# Altium schematic sheet Schematic.SchDoc
size A; SheetNumber: 1; SheetTotal: 1
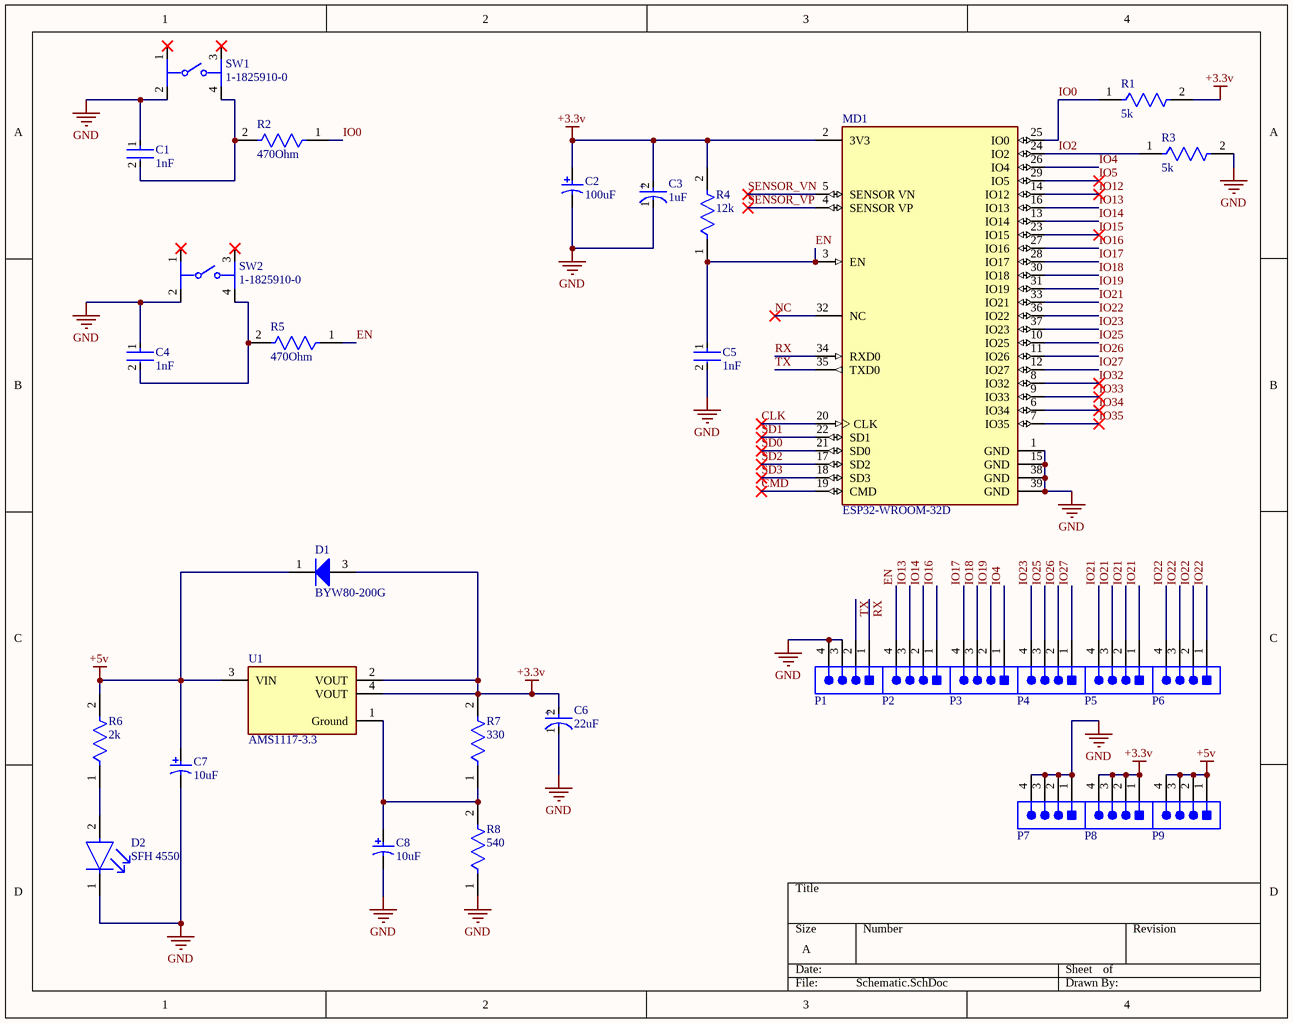
[diagram p0: Schematic.SchDoc]

## Parts
C1  1nF  [FP-VY2102M29Y5US6TV7-MFG]
C2  100uF  [NIC-RNS-8x11.5-2_V]
C3  1uF  [FP-ECA-2WHG010-MFG]
C4  1nF  [FP-VY2102M29Y5US6TV7-MFG]
C5  1nF  [FP-VY2102M29Y5US6TV7-MFG]
C6  22uF  [FP-RAD-TH-D_16_0_5-L_20_2-MFG]
C7  10uF  [NIC-RNS-8x11.5-2_V]
C8  10uF  [NIC-RNS-8x11.5-2_V]
D1  BYW80-200G  [ONSC-TO-220-2-221B-04_E]
D2  SFH 4550  [FP-SFH_4550-MFG]
MD1  ESP32-WROOM-32D  [FP-ESP32-WROOM-32D-MFG]
P1  B4B-EH-A(LF)(SN)  [JST-B4B-EH-A_V]  (value not drawn)
P2  B4B-EH-A(LF)(SN)  [JST-B4B-EH-A_V]  (value not drawn)
P3  B4B-EH-A(LF)(SN)  [JST-B4B-EH-A_V]  (value not drawn)
P4  B4B-EH-A(LF)(SN)  [JST-B4B-EH-A_V]  (value not drawn)
P5  B4B-EH-A(LF)(SN)  [JST-B4B-EH-A_V]  (value not drawn)
P6  B4B-EH-A(LF)(SN)  [JST-B4B-EH-A_V]  (value not drawn)
P7  B4B-EH-A(LF)(SN)  [JST-B4B-EH-A_V]  (value not drawn)
P8  B4B-EH-A(LF)(SN)  [JST-B4B-EH-A_V]  (value not drawn)
P9  B4B-EH-A(LF)(SN)  [JST-B4B-EH-A_V]  (value not drawn)
R1  5k  [FP-MRS1600-MFG]
R2  470Ohm  [FP-MRS1600-MFG]
R3  5k  [FP-MRS1600-MFG]
R4  12k  [FP-MRS1600-MFG]
R5  470Ohm  [FP-MRS1600-MFG]
R6  2k  [FP-MRS1600-MFG]
R7  330  [FP-MRS1600-MFG]
R8  540  [FP-MRS1600-MFG]
SW1  1-1825910-0  [FP-1-1825910-0-MFG]
SW2  1-1825910-0  [FP-1-1825910-0-MFG]
U1  AMS1117-3.3  [FP-AMS1117-IPC_C]

## Nets
+3.3v: C2.1 C3.2(A) C6.2(A) D1.3(A) MD1.2(3V3) P8.1 P8.2 P8.3 P8.4 R1.2 R4.2 R7.2 U1.2(VOUT) U1.4(VOUT)
+5v: C7.1 D1.1(K) P9.1 P9.2 P9.3 P9.4 R6.2 U1.3(VIN)
GND: C1.1 C2.2 C3.1(C) C4.1 C5.2 C6.1(C) C7.2 C8.2 D2.1(C) MD1.1(GND) MD1.15(GND) MD1.38(GND) MD1.39(GND) P1.3 P1.4 P7.1 P7.2 P7.3 P7.4 R3.2 R8.1 SW1.2 SW2.2
CLK: MD1.20(CLK)
CMD: MD1.19(CMD)
EN: C5.1 MD1.3(EN) P2.4 R4.1 R5.1
IO0: MD1.25(IO0) R1.1 R2.1
IO2: MD1.24(IO2) R3.1
IO4: MD1.26(IO4) P3.1
IO5: MD1.29(IO5)
IO12: MD1.14(IO12)
IO13: MD1.16(IO13) P2.3
IO14: MD1.13(IO14) P2.2
IO15: MD1.23(IO15)
IO16: MD1.27(IO16) P2.1
IO17: MD1.28(IO17) P3.4
IO18: MD1.30(IO18) P3.3
IO19: MD1.31(IO19) P3.2
IO21: MD1.33(IO21) P5.1 P5.2 P5.3 P5.4
IO22: MD1.36(IO22) P6.1 P6.2 P6.3 P6.4
IO23: MD1.37(IO23) P4.4
IO25: MD1.10(IO25) P4.3
IO26: MD1.11(IO26) P4.2
IO27: MD1.12(IO27) P4.1
IO32: MD1.8(IO32)
IO33: MD1.9(IO33)
IO34: MD1.6(IO34)
IO35: MD1.7(IO35)
NC: MD1.32(NC)
RX: MD1.34(RXD0) P1.1
SD0: MD1.21(SD0)
SD1: MD1.22(SD1)
SD2: MD1.17(SD2)
SD3: MD1.18(SD3)
SENSOR_VN: MD1.5(SENSOR_VN)
SENSOR_VP: MD1.4(SENSOR_VP)
TX: MD1.35(TXD0) P1.2
NetC1_2: C1.2 R2.2 SW1.4
NetC4_2: C4.2 R5.2 SW2.4
NetC8_1: C8.1 R7.1 R8.2 U1.1(Ground)
NetD2_2: D2.2(A) R6.1

Not connected (* = marked no-connect by the designer): SW1 1* 3*; SW2 1* 3*

## Notes on the sheet
- (in symbol CMP-00287-55558411-1) +
- (in symbol CMP-05427-000893-1) +

## Library data of the parts
C1 C4 C5 = CMP-00030-42817980-1: VY2102M29Y5US6TV7 Cap Ceramic Suppression X1/Y2 0.001uF 440VAC/300VAC Y5U 20% (7.5 X 5mm) Radial 7.5mm 125C T/R; Lead/Base Style: Kinked; Lead Diameter: 600µm; Voltage: 300V; Voltage Rating: 1kV; Capacitance: 1nF; Case/Package: Radial; Height: 10.5mm; REACH SVHC: Unknown; Packaging: Tape & Reel (TR); Lead Free: Lead Free; RoHS: Compliant; Min Operating Temperature: -40°C; Max Operating Temperature: 125°C; Termination: Radial; Composition: Ceramic; Depth: 5mm; Dielectric: Y5U; Diameter: 7.5mm; Lead Pitch: 7.5mm; Schedule B: 8532230060, 8532230060; Radiation Hardening: No; Tolerance: 20%; Height - Seated (Max): 11.5062mm; Voltage Rating (AC): 300V; Material: Ceramic; Mount: Through Hole; NexarPartId: 42817980
C2 = CMP-1235-00001-1: Aluminum Electrolytic Capacitor, 100 uF +/-20%, 10 V, -55 to 105 degC, 2-Pin THD, RoHS; PartNumber: RNS1A101MDN1KX; Manufacturer: Nichicon; Rated Ripple: 3900 mA; Rated Voltage: 10 V; Leakage Current: 0.15 mA; Capacitance Tolerance: +/-20%; ComponentLink1URL: http://www.nichicon.co.jp/; ComponentLink3URL: http://www.nichicon.co.jp/english/products/pdf/2013fpcap_catalog_ns.pdf; ComponentLink1Description: Manufacturer URL; ComponentLink2URL: http://www.nichicon.co.jp/english/products/pdfs/e-ns.pdf; PackageDescription: 2-Pin Through Hole Device, Dia 8 mm, Body Length 11.5 mm, Pin Spacing 3.5 mm; Temperature Range: -55 to 105 degC; ComponentLink3Description: Package Specification; Mounting Technology: Through Hole; DatasheetVersion: Sep-13; RoHS: TRUE; ComponentLink2Description: Datasheet; Rated Capacitance: 100 uF
C3 = CMP-00287-55558411-1: ECA-2WHG010 Aluminum Electrolytic Capacitor, 1 uF, 450 V, ± 20%, 2000 hours @ 105°C, Radial Leaded; Dielectric Material: Aluminium; Voltage Rating: 450V; Capacitance: 1µF; Dissipation Factor: 0.24%; Lead Diameter: 600µm; Ripple Current: 18mA; Lead/Base Style: Straight; Packaging: Bulk; Width: 8mm; Lead Pitch: 3.5mm; Termination: Radial; Contact Plating: Tin; Length: 11.5mm; Radiation Hardening: No; Voltage Rating (DC): 450V; Max Operating Temperature: 105°C; REACH SVHC: No SVHC; Min Operating Temperature: -25°C; Diameter: 8mm; RoHS: Compliant; Mount: PCB, Through Hole; Tolerance: 20%; Schedule B: 8532220020, 8532220020; Height: 11.5mm; Lead Free: Lead Free; Number of Pins: 2; Height - Seated (Max): 12.4968mm; Life (Hours): 2000hours; Voltage: 450V; Voltage Rating (AC): 450V; NexarPartId: 55558411; Case/Package: Radial
C6 = CMP-05427-000893-1: Aluminum Electrolytic Capacitors (Radial Lead Type) 22uF ±20% 450V; Lead Diameter: 0.8mm; Dissipation Factor: 0.24%; Ripple Current: 945mA; Life (Hours): 10000Hour; Dielectric Material: Aluminium; Leakage Current: 604uA; Min Operating Temperature: -25°C; Mount: Through Hole; Lead Pitch: 7.5mm; Termination: Radial; Radiation Hardening: No; REACH SVHC: No SVHC; Height - Seated (Max): 0.787inch; Voltage Rating (DC): 450V; Packaging: Bulk; Case/Package: Radial; Tolerance: 20%; Capacitance: 22uF; Max Operating Temperature: 105°C; Series: EE; Diameter: 16mm; RoHS Compliant: Yes; Voltage Rating: 450V; Height: 20mm; Construction: RADIAL; Voltage: 450V; Package Quantity: 100; Contact Plating: Tin; Length: 20mm; Lead Free: Lead Free
C7 C8 = CMP-1235-00001-1: Aluminum Electrolytic Capacitor, 100 uF +/-20%, 10 V, -55 to 105 degC, 2-Pin THD, RoHS; PartNumber: RNS1A101MDN1KX; Manufacturer: Nichicon; Rated Ripple: 3900 mA; Rated Voltage: 10 V; Leakage Current: 0.15 mA; Rated Capacitance: 100 uF; Capacitance Tolerance: +/-20%; ComponentLink1URL: http://www.nichicon.co.jp/; ComponentLink3URL: http://www.nichicon.co.jp/english/products/pdf/2013fpcap_catalog_ns.pdf; ComponentLink1Description: Manufacturer URL; ComponentLink2URL: http://www.nichicon.co.jp/english/products/pdfs/e-ns.pdf; PackageDescription: 2-Pin Through Hole Device, Dia 8 mm, Body Length 11.5 mm, Pin Spacing 3.5 mm; Temperature Range: -55 to 105 degC; ComponentLink3Description: Package Specification; Mounting Technology: Through Hole; DatasheetVersion: Sep-13; RoHS: TRUE; ComponentLink2Description: Datasheet
D1 = CMP-0902-00381-1: SWITCHMODE(TM) Power Rectifier, 2-Pin TO-220, Pb-Free, Tube; Manufacturer: On Semiconductor; Type: Ultrafast; IFSM Max (A): 100; VRRM Max (V): 200; RoHS: TRUE; PartNumber: BYW80-200G; ComponentLink1URL: http://www.onsemi.com/; ComponentLink2URL: http://www.onsemi.com/pub_link/Collateral/BYW80-D.PDF; PackageVersion: Rev. E; PackageReference: TO-220-2-221B-04_E; ComponentLink3URL: http://www.onsemi.com/pub_link/Collateral/BYW29-D.PDF; PackageDescription: 2-Pin Flange Mount, Vertical Straight Lead, Body 9.97 x 4.44 mm, Pitch 5.08 mm; DatasheetVersion: Rev. 3; ComponentLink2Description: Datasheet; ComponentLink1Description: Manufacturer URL; ComponentLink3Description: Package Specification; Packing: Tube; Mounting Technology: Through Hole
D2 = CMP-62016-000011-1: EMITTER IR 860NM 100MA RADIAL; Manufacturer: Osram Opto; Forward Voltage: 1.5V; Reverse Voltage: 5V; Viewing Angle: 6°; Led Orientation: Straight; Colour: Infrared; Mouser Description: Infrared Emitters - High Power Infrared 850 nm HALF ANGLE +/-3DEG; RoHS: TRUE; Manufacturer Part Number: SFH 4550; Forward Current: 100mA; Octopart: https://octopart.com/sfh+4550-osram+opto-55410894; ComponentLink2Description: Datasheet; Lead Free: Yes; Temperature: -40°C to +100°C; ComponentLink2URL: https://dammedia.osram.info/media/resource/hires/osram-dam-5580407/SFH%204550_EN.pdf; Device Class L2: LEDs; Temperature Range Low: -40°C; Digikey Description: EMITTER IR 860NM 100MA RADIAL; Temperature Range High: +100°C; Device Class L3: unset; Peak Emmision Wavelength: 860nm; Category: Diode; Package: SFH 4550; Device Class L1: Optoelectronics; Automotive: No
MD1 = CMP-194065-000003-1: WIFI MODULE 32MBITS SPI FLASH; Manufacturer: Espressif Systems; Max Supply Voltage: 3.6V; Nominal Supply Current: 500mA; Max Frequency: 2484MHz; Number Of Adc Channels: 16; Number Of Gpio: 32; Interface: I2C,SPI,UART,Ethernet,I2S,Other; Data Rate: 150Mbits/s; Min Supply Voltage: 3V; Bandwidth: 72MHz; Sensitivity: -98dBm; Octopart: https://octopart.com/esp32-wroom-32d-espressif+systems-91040050; Package: ESP32-WROOM-32D; ComponentLink2URL: https://www.espressif.com/sites/default/files/documentation/esp32-wroom-32d_esp32-wroom-32u_datasheet_en.pdf; Lead Free: Yes; Category: UNK; Mouser Description: Wi-Fi/BT BLE Module ESP32-D0WD, SPI Flash, UART, P; Device Class L1: Integrated Circuits (ICs); RoHS: TRUE; Temperature Range Low: -40°C; ComponentLink2Description: Datasheet; Digikey Description: WIFI MODULE 32MBITS SPI FLASH; Height: 3.2mm; Temperature: -40°C to +85°C; Manufacturer Part Number: ESP32-WROOM-32D; Device Class L3: Transceivers; Device Class L2: RF Semiconductors and Devices; Temperature Range High: +85°C; Automotive: No
P1-P9 = CMP-2000-05904-1: Male Header, Pitch 2.5 mm, 1 x 4 Position, Height 6 mm, Tail Length 3.2 mm, -25 to 85 degC, RoHS, Bulk; Manufacturer: JST; Style/Orientation: StraightHeader/Plug; Pitch: 2.5mm; No of Positions: 4; Mounting Technology: SurfaceMount; Package Description: Male Header, Pitch 2.5 mm, 1 x 4 Position, Height 6 mm, Tail Length 3.2 mm; Datasheet Version: 12/2012; Type: ShroudedHeader; Package Reference: B4B-EH-A; Manufacturer URL: http://www.jst.com/home2.html; Termination: Crimp; Datasheet URL: http://www.jst-mfg.com/product/pdf/eng/eEH.pdf
R1-R8 = CMP-02408-000019-1: RES 20K OHM 0.4W 1% AXIAL; Max Power Dissipation: 400mW; Temperature Coefficient: 50ppm/°C; Resistance: 20kR; Technology: THIN FILM; Max Operating Temperature: 155°C; Number of Terminations: 2; RoHS Compliant: Yes; Packaging: Tape and Reel; Radiation Hardening: No; Contact Plating: Tin; Military Standard: Not; Construction: Cylindrical; Diameter: 1.6mm; Tolerance: 1%; Mount: Through Hole; Power Rating: 400mW; Case/Package: Conformal; Termination: Axial; Length: 3.6mm; Min Operating Temperature: -55°C; Resistor Type: Metal Film; Series: MRS16
SW1 SW2 = CMP-03407-000018-1: SWITCH TACTILE SPST-NO 0.05A 24V; Switch Function: Off-Mom; Mechanical Life: 100000Cycles; Actuator Material: Nylon; Actuator Color: Blue; Contact Current Rating: 50mA; Illumination Type: Non-Illuminated; Throw Configuration: SPST; Actuator Length: 3.4mm; Operating Force: 1.56N; Actuator Type: Standard; Contact Resistance: 100mR; Switch Travel: 0.25mm; Depth: 5.99mm; Contact Plating: Silver; Max Operating Temperature: 85°C; Electrical Life: 100000Cycles; Min Operating Temperature: -35°C; RoHS Compliant: Yes; Max Voltage Rating (DC): 24V; Mount: Through Hole; Packaging: Loose Piece; Length: 5.99mm; Series: FSMJ, Alcoswitch; Orientation: Straight; Contact Material: Brass; Radiation Hardening: No; Package Quantity: 750; Max Current Rating: 50mA; Termination: PC Pins; Type: Switch; Voltage Rating (DC): 24V
U1 = CMP-209535-000001-1: LDO Voltage Regulators 1A, 3.3V; Manufacturer: Advanced Monolithic Systems; Dropout Voltage: 1.1V; Output Type: Fixed; Nominal Supply Current: 5mA; Max Power Dissipation: 1.2W; Max Supply Voltage: 15V; Number Of Outputs: 1; Standoff Height: 0.64mm; Max Junction Temp: +125°C; Height: 1.8mm; Package: AMS1117; Device Class L2: Power Management ICs; ComponentLink2Description: Datasheet; ComponentLink2URL: http://www.advanced-monolithic.com/pdf/ds1117.pdf; Category: IC; RoHS: TRUE; Automotive: No; Device Class L1: Integrated Circuits (ICs); Output Current: 1A; Device Class L3: Voltage Regulators - Linear; Temperature: -40°C to +125°C; Output Voltage: 3.3V; Manufacturer Part Number: AMS1117-3.3; Temperature Range Low: -40°C; Octopart: https://octopart.com/ams1117-3.3-advanced+monolithic+systems-25899300; Lead Free: Yes; Ipc Land Pattern Name: SOT229P700X180-4; Temperature Range High: +125°C